# Altium schematic sheet Regulator.SchDoc
size A
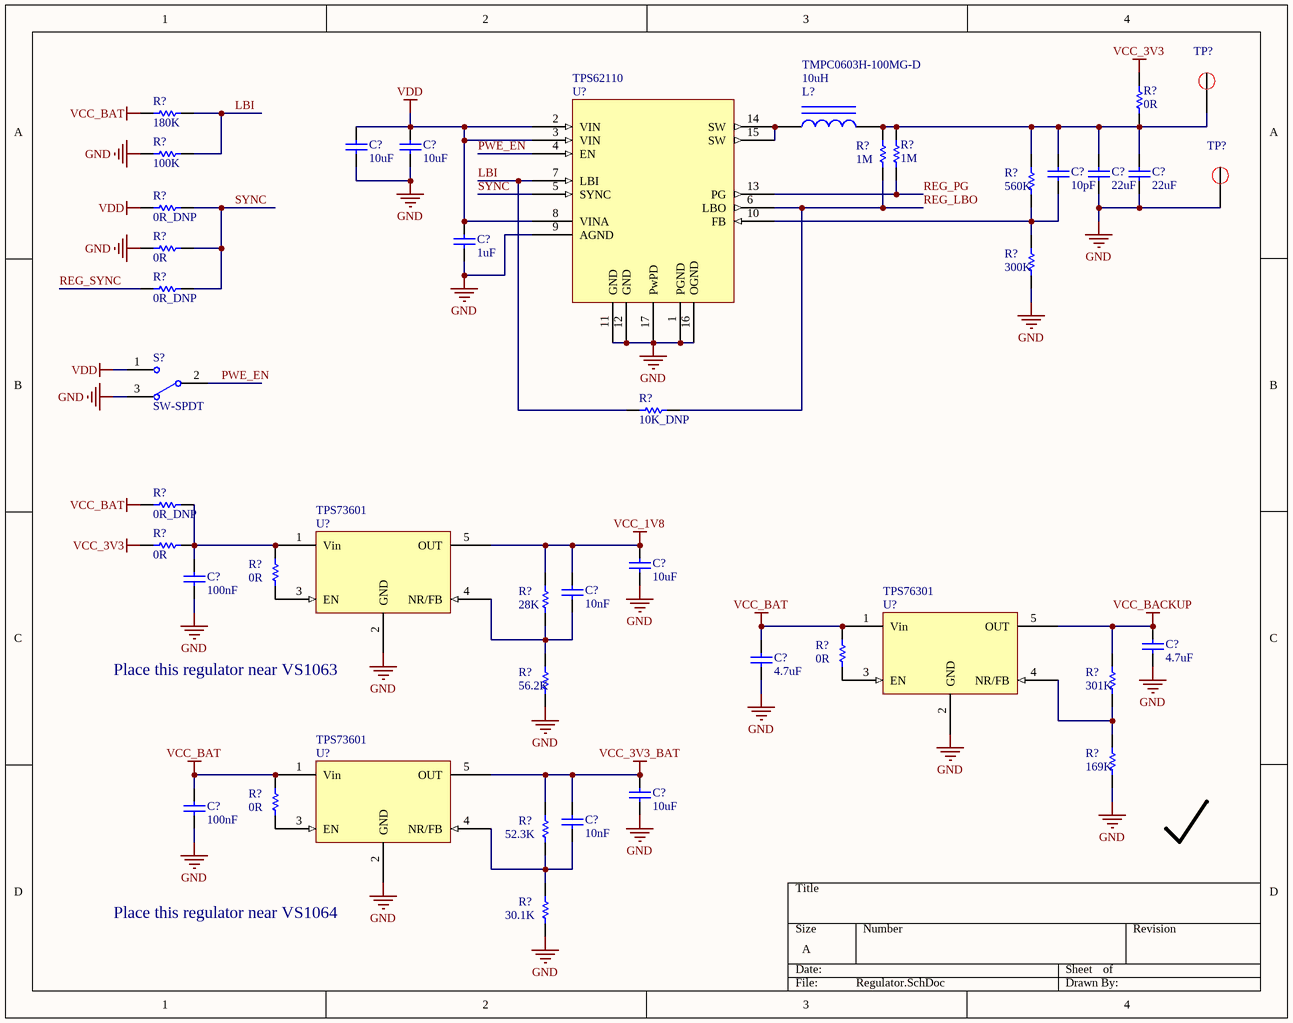
[diagram p0: Regulator.SchDoc]

## Parts
(Parts that share a designator on the sheet are numbered #1, #2 ... from top to bottom, then left to right.)
C?#1  value 10uF  [C1206]  (hidden comment: Cap Semi)
C?#2  value 10uF  [C1206]  (hidden comment: Cap Semi)
C?#3  value 10pF  [0603PKG]  (hidden comment: Cap Semi)
C?#4  value 22uF  [C1206]  (hidden comment: Cap Semi)
C?#5  value 22uF  [C1206]  (hidden comment: Cap Semi)
C?#6  value 1uF  [0603PKG]  (hidden comment: Cap Semi)
C?#7  value 10uF  [0603PKG]  (hidden comment: Cap Semi)
C?#8  value 100nF  [0603PKG]  (hidden comment: Cap Semi)
C?#9  value 10nF  [0603PKG]  (hidden comment: Cap Semi)
C?#10  value 4.7uF  [C0805]  (hidden comment: Cap Semi)
C?#11  value 4.7uF  [C0805]  (hidden comment: Cap Semi)
C?#12  value 10uF  [0603PKG]  (hidden comment: Cap Semi)
C?#13  value 100nF  [0603PKG]  (hidden comment: Cap Semi)
C?#14  value 10nF  [0603PKG]  (hidden comment: Cap Semi)
L?  TMPC0603H-100MG-D  value 10uH  [CAPM3216X18N]
R?#1  value 0R  [C0805]  (hidden comment: Res1)
R?#2  value 180K  [0603PKG]  (hidden comment: Res1)
R?#3  value 1M  [0603PKG]  (hidden comment: Res1)
R?#4  value 100K  [0603PKG]  (hidden comment: Res1)
R?#5  value 1M  [0603PKG]  (hidden comment: Res1)
R?#6  value 560K  [0603PKG]  (hidden comment: Res1)
R?#7  value 0R_DNP  [0603PKG]  (hidden comment: Res1)
R?#8  value 0R  [0603PKG]  (hidden comment: Res1)
R?#9  value 300K  [0603PKG]  (hidden comment: Res1)
R?#10  value 0R_DNP  [0603PKG]  (hidden comment: Res1)
R?#11  value 10K_DNP  [0603PKG]  (hidden comment: Res1)
R?#12  value 0R_DNP  [0603PKG]  (hidden comment: Res1)
R?#13  value 0R  [0603PKG]  (hidden comment: Res1)
R?#14  value 0R  [0603PKG]  (hidden comment: Res1)
R?#15  value 28K  [0603PKG]  (hidden comment: Res1)
R?#16  value 0R  [0603PKG]  (hidden comment: Res1)
R?#17  value 56.2K  [0603PKG]  (hidden comment: Res1)
R?#18  value 301K  [0603PKG]  (hidden comment: Res1)
R?#19  value 169K  [0603PKG]  (hidden comment: Res1)
R?#20  value 0R  [0603PKG]  (hidden comment: Res1)
R?#21  value 52.3K  [0603PKG]  (hidden comment: Res1)
R?#22  value 30.1K  [0603PKG]  (hidden comment: Res1)
S?  SW-SPDT  [Slide switch]
TP?#1  TP  [TP_15]  (value not drawn)
TP?#2  TP  [TP_15]  (value not drawn)
U?#1  value TPS62110  [QFN16-4*4*0.65]  (hidden comment: Buck converter)
U?#2  TPS73601  [SOT23-5]
U?#3  TPS76301  [SOT23-5]
U?#4  TPS73601  [SOT23-5]

## Nets
GND: C?#1.2 C?#2.2 C?#4.2 C?#5.2 C?#6.2 C?#7.2 C?#8.2 C?#10.2 C?#11.2 C?#12.2 C?#13.2 R?#4.2 R?#8.2 R?#9.1 R?#17.1 R?#19.1 R?#22.1 S?.3 TP?#2.1 U?#1.1(PGND) U?#1.9(AGND) U?#1.11(GND) U?#1.12(GND) U?#1.16(OGND) U?#1.17(PwPD) U?#2.2(GND) U?#3.2(GND) U?#4.2(GND)
VCC_1V8: C?#7.1 C?#9.1 R?#15.2 U?#2.5(OUT)
VCC_3V3: R?#1.1 R?#13.2
VCC_3V3_BAT: C?#12.1 C?#14.1 R?#21.2 U?#4.5(OUT)
VCC_BACKUP: C?#10.1 R?#18.2 U?#3.5(OUT)
VCC_BAT: C?#11.1 C?#13.1 R?#2.2 R?#12.2 R?#16.2 R?#20.2 U?#3.1(Vin) U?#4.1(Vin)
VDD: C?#1.1 C?#2.1 C?#6.1 R?#7.2 S?.1 U?#1.2(VIN) U?#1.3(VIN) U?#1.8(VINA)
LBI: R?#2.1 R?#4.1 R?#11.2 U?#1.7(LBI)
PWE_EN: S?.2 U?#1.4(EN)
REG_LBO: R?#5.1 R?#11.1 U?#1.6(LBO)
REG_PG: R?#3.2 U?#1.13(PG)
REG_SYNC: R?#10.2
SYNC: R?#7.1 R?#8.1 R?#10.1 U?#1.5(SYNC)
NetC?#3_1: C?#3.1 C?#4.1 C?#5.1 L?.2 R?#1.2 R?#3.1 R?#5.2 R?#6.2 TP?#1.1
NetC?#3_2: C?#3.2 R?#6.1 R?#9.2 U?#1.10(FB)
NetC?#8_1: C?#8.1 R?#12.1 R?#13.1 R?#14.2 U?#2.1(Vin)
NetC?#9_2: C?#9.2 R?#15.1 R?#17.2 U?#2.4(NR/FB)
NetC?#14_2: C?#14.2 R?#21.1 R?#22.2 U?#4.4(NR/FB)
NetL?_1: L?.1 U?#1.14(SW) U?#1.15(SW)
NetR?#14_1: R?#14.1 U?#2.3(EN)
NetR?#16_1: R?#16.1 U?#3.3(EN)
NetR?#18_1: R?#18.1 R?#19.2 U?#3.4(NR/FB)
NetR?#20_1: R?#20.1 U?#4.3(EN)

## Notes on the sheet
- Place this regulator near VS1063
- Place this regulator near VS1064

## Library data of the parts
C?#1-C?#14 = Cap Semi: Capacitor (Semiconductor SIM Model); Published: 8-Jun-2000; LatestRevisionDate: 29-May-2009; LatestRevisionNote: IPC-7351 Footprint Added.; PackageReference: C1206; Publisher: Altium Limited; PackageDescription: Chip Capacitor
L? = Inductor Iron: Magnetic-Core Inductor; Published: 24-Mar-1999; LatestRevisionDate: 17-Jul-2002; LatestRevisionNote: Re-released for DXP Platform.; PackageReference: AXIAL-0.9; Publisher: Altium Limited; PackageDescription: Axial Device, Thru-Hole; 2 Leads; 0.9 in Pin Spacing
R?#1-R?#22 = Res1: Resistor; Published: 8-Jun-2000; LatestRevisionDate: 17-Jul-2002; LatestRevisionNote: Re-released for DXP Platform.; PackageReference: AXIAL-0.3; Publisher: Altium Limited; PackageDescription: Axial Device, Thru-Hole; 2 Leads; 0.3 in Pin Spacing
S? = SW-SPDT: SPDT Subminiature Toggle Switch, Right Angle Mounting, Vertical Actuation; Published: 24-Mar-1999; LatestRevisionDate: 17-Dec-2003; LatestRevisionNote: Schematic revised, PCB Footprint replaced.; DatasheetVersion: 05-Dec-2000; PackageReference: TL36WW15050; Publisher: Altium Limited; PackageDescription: Switch; 4 Leads; ComponentLink1Description: Manufacturer Link; ComponentLink1URL: http://www.apem.com
TP?#1 TP?#2 = Test Point
U?#1 = TPS62110: 17-V, 1.5-A, SYNCHRONOUS STEP-DOWN CONVERTER
U?#2 U?#4 = TPS73601: TPS736xx Cap-Free, NMOS, 400-mA Low-Dropout Regulator with Reverse Current  Protection
U?#3 = TPS76301: TPS763 Low-Power 150-mA Low-Dropout Linear Regulators